# Altium schematic sheet Maincirc.SchDoc
size A; SheetNumber: 1; SheetTotal: 1
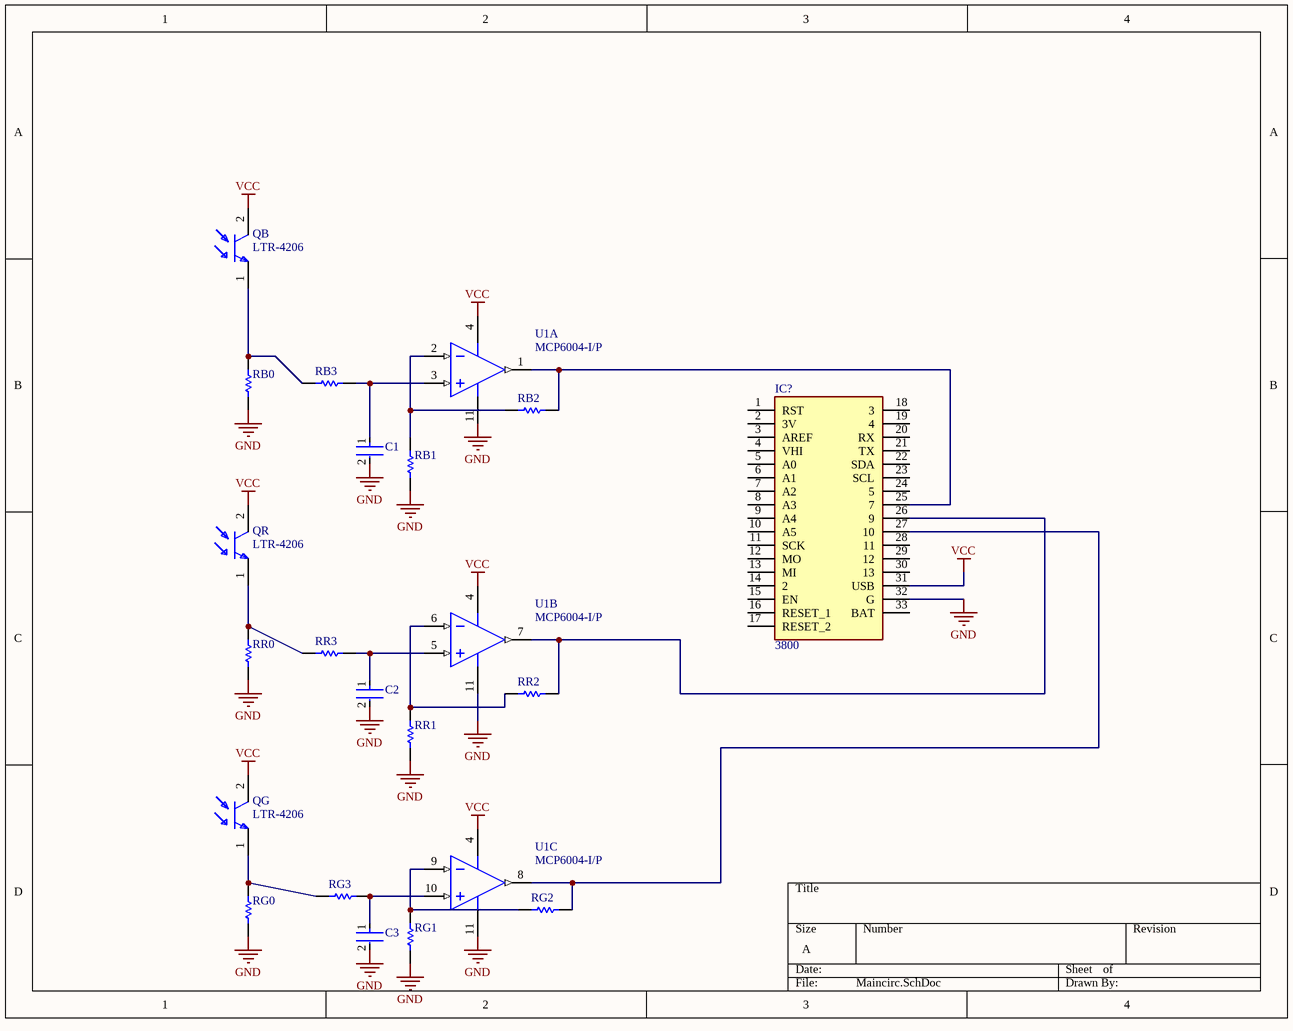
[diagram p0: Maincirc.SchDoc]

## Parts
C1  DE6E3KJ472MN3A  [FP-DE6_D12_T7_F7_5_d0_6-0-MFG]  (value not drawn)
C2  DE6E3KJ472MN3A  [FP-DE6_D12_T7_F7_5_d0_6-0-MFG]  (value not drawn)
C3  DE6E3KJ472MN3A  [FP-DE6_D12_T7_F7_5_d0_6-0-MFG]  (value not drawn)
IC?  3800  [3800]
QB  LTR-4206  [FP-LTR-4206-MFG]
QG  LTR-4206  [FP-LTR-4206-MFG]
QR  LTR-4206  [FP-LTR-4206-MFG]
RB0  OD103JE  [OMTE-RES7X2.5-2]  (value not drawn)
RB1  OD103JE  [OMTE-RES7X2.5-2]  (value not drawn)
RB2  OD103JE  [OMTE-RES7X2.5-2]  (value not drawn)
RB3  OD103JE  [OMTE-RES7X2.5-2]  (value not drawn)
RG0  OD103JE  [OMTE-RES7X2.5-2]  (value not drawn)
RG1  OD103JE  [OMTE-RES7X2.5-2]  (value not drawn)
RG2  OD103JE  [OMTE-RES7X2.5-2]  (value not drawn)
RG3  OD103JE  [OMTE-RES7X2.5-2]  (value not drawn)
RR0  OD103JE  [OMTE-RES7X2.5-2]  (value not drawn)
RR1  OD103JE  [OMTE-RES7X2.5-2]  (value not drawn)
RR2  OD103JE  [OMTE-RES7X2.5-2]  (value not drawn)
RR3  OD103JE  [OMTE-RES7X2.5-2]  (value not drawn)
U1  MCP6004-I/P  [PDIP300-P14]  (parts A,B,C of 4)

## Nets
GND: C1.2 C2.2 C3.2 IC?.32(G) RB0.1 RB1.1 RG0.1 RG1.1 RR0.1 RR1.1 U1.11(VSS)
VCC: IC?.31(USB) QB.2(C) QG.2(C) QR.2(C) U1.4(VDD)
NetC1_1: C1.1 RB3.2 U1.3(VINA+)
NetC2_1: C2.1 RR3.2 U1.5(VINB+)
NetC3_1: C3.1 RG3.2 U1.10(VINC+)
NetIC?_25: IC?.25(7) RB2.1 U1.1(VOUTA)
NetIC?_26: IC?.26(9) RR2.1 U1.7(VOUTB)
NetIC?_27: IC?.27(10) RG2.1 U1.8(VOUTC)
NetQB_1: QB.1(E) RB0.2 RB3.1
NetQG_1: QG.1(E) RG0.2 RG3.1
NetQR_1: QR.1(E) RR0.2 RR3.1
NetRB1_2: RB1.2 RB2.2 U1.2(VINA-)
NetRG1_2: RG1.2 RG2.2 U1.9(VINC-)
NetRR1_2: RR1.2 RR2.2 U1.6(VINB-)

Not connected (* = marked no-connect by the designer): IC? 1(RST) 2(3V) 3(AREF) 4(VHI) 5(A0) 6(A1) 7(A2) 8(A3) 9(A4) 10(A5) 11(SCK) 12(MO) 13(MI) 14(2) 15(EN) 16(RESET_1) 17(RESET_2) 18(3) 19(4) 20(RX) 21(TX) 22(SDA) 23(SCL) 24(5) 28(11) 29(12) 30(13) 33(BAT)

## Library data of the parts
C1-C3 = CMP-06035-062312-1: CAP CER 4700PF 300VAC RADIAL; Tolerance: 20%; Lead/Base Style: Formed Leads; Lead Diameter: 0.6mm; Material: Ceramic; Voltage Rating (AC): 300V; Capacitance: 4.7nF; Termination: Radial; Case/Package: Radial; Width: 7mm; Height - Seated (Max): 0.591inch; Resistor Type: Ceramic; Ratings: AEC-Q200; Lead Pitch: 7.5mm; RoHS Compliant: Yes; Depth: 7mm; Min Operating Temperature: -25°C; Max Operating Temperature: 125°C; Series: KJ; Packaging: Cut Tape; Package Quantity: 700; Mount: Through Hole; REACH SVHC: No SVHC
IC? = 3800: Integrated Circuit; Manufacturer_Name: Adafruit; Datasheet Link: https://cdn-learn.adafruit.com/downloads/pdf/introducing-adafruit-itsybitsy-m4.pdf; Height: 4.2mm; Manufacturer_Part_Number: 3800; Mouser Part Number: 485-3800; Mouser Price/Stock: https://www.mouser.co.uk/ProductDetail/Adafruit/3800?qs=%252BEew9%252B0nqrDEEFcTIFoyAg%3D%3D; Arrow Part Number: 3800; Arrow Price/Stock: https://www.arrow.com/en/products/3800/adafruit-industries
QB QG QR = CMP-22030-000001-1: SENSOR PHOTO 940NM TOP VIEW T1; Manufacturer: Lite-On; Viewing Angle: 20°; Wavelength: 900nm; Fall Time: 10us; Dark Current: 0.1uA; Collector Emitter Breakdown Voltage: 30V; Power Dissipation: 100mW; Max Collector Current: 9.6mA; RoHS: TRUE; ComponentLink2URL: http://optoelectronics.liteon.com/upload/download/DS-50-92-0072/R4206.pdf; Lead Free: Yes; Temperature Range Low: -40°C; Manufacturer Part Number: LTR-4206; Device Class L1: Sensors; Package: LTR-4206; Mouser Description: Phototransistors Phototrans Clear; Device Class L2: Optical Sensors; Category: Trans; Digikey Description: SENSOR PHOTO 940NM TOP VIEW T1; Automotive: No; Temperature: -40°C to +85°C; ComponentLink2Description: Datasheet; Rise Time: 10us; Octopart: https://octopart.com/ltr-4206-lite-on-707502; Temperature Range High: +85°C; Device Class L3: Phototransistor; Led Orientation: Top View; Height: 6.65mm
RB0-RB3 RG0-RG3 RR0-RR3 = CMP-2000-06865-1: Little Demon(R) Carbon Composition Molded OD Series, 250 V, 10 KOhm, +/-5%, -70 to 130 degC, 2-Pin THD, RoHS, Bulk; Manufacturer: Ohmite; Resistance (Ohms): 10k; Power Rating: 0.25W; Power (Watts): 0.25W,1/4W; Tolerance: ±5%; Online Catalog: OD,OF,OASeries,LittleDemon®; Catalog Drawings: OD,OF,OASeries; EDA / CAD Models: DownloadfromAcceleratedDesigns; Mounting Technology: ThroughHole; Datasheet Version: 06/2016; RoHS Information: LittleDemon"E"SeriesMaterialDeclaration; Number of Terminations: 2; Temperature Coefficient: -; Height: -; Composition: CarbonComposition; Package Description: 2-Pin THD Resistor, Body 7 x 2.5 mm, Lead Dia. 0.6 mm; Size / Dimension: 0.098"Diax0.276"L(2.50mmx7.00mm); Category: Resistors; Manufacturer URL: http://www.ohmite.com/; Features: PulseWithstanding; Family: ThroughHoleResistors; PartNumber: OD103JE; Supplier Device Package: Axial; Package / Case: Axial; Standard Package: 100; Package Reference: RES7X2.5; Operating Temperature: -; Series: LittleDemon®OD; Datasheet URL: http://www.ohmite.com/cat/res_od_of_oa.pdf; Packaging: Bulk
U1 = CMP-0187-00122-3: None; Number of Elements: 4; Supply Current: 100uA; Input Bias Current: 1pA; Input Offset Voltage (Vos): 4.5mV; Min Supply Voltage: 1.8V; Unity Gain Bandwidth Product: 1MHz; Output Current: 23mA; Amplifier Type: GENERAL PURPOSE; Common Mode Rejection Ratio: 60dB; Max Supply Voltage: 6V; Slew Rate: 0.6V/µs; Voltage Gain: 112dB; Operating Supply Voltage: 5.5V; Power Supply Rejection Ratio (PSRR): 86dB; Number of Pins: 14; Radiation Hardening: No; Package Quantity: 30; Number of Circuits: 4; Technology: CMOS; Height: 3.3mm; Lead Free: Lead Free; RoHS Compliant: Yes; Input Offset Voltage-Max: 4.5mV; Min Operating Temperature: -40°C; Max Operating Temperature: 85°C; Length: 19.05mm; Packaging: Rail/Tube; Width: 6.35mm; Number of Amplifiers: 4; Number of Channels: 4; REACH SVHC: No SVHC; Mount: Through Hole; Output Current per Channel: 23mA; Slew Rate-Nom: 0.6V/µs; Case/Package: PDIP; Operating Supply Current: 100uA; Gain Bandwidth Product: 1MHz; Nominal Supply Current: 100uA